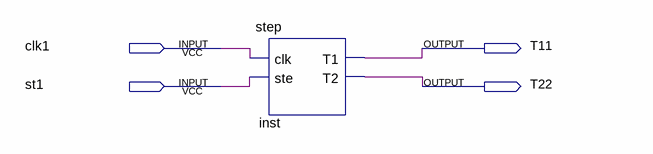
[diagram p0: schematic sheet]
// Quartus schematic step.bdf as structural Verilog: 1 symbols, 4 pins
module step (
  input  clk1,
  input  st1,
  output T11,
  output T22
);

  step inst (.clk(clk1), .ste(st1), .T1(T11), .T2(T22));
endmodule
